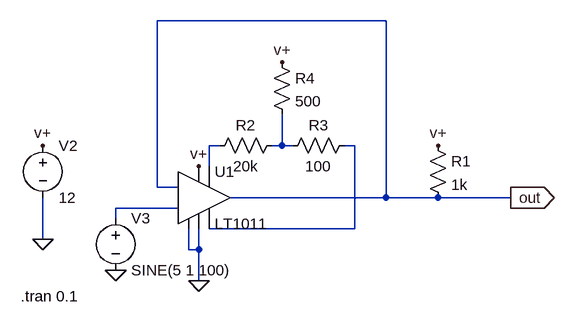
[diagram p0: schematic comparator_with_offset.asc]
comparator_with_offset.asc, the LTspice schematic file:
Version 4
SHEET 1 880 680
WIRE 416 -112 64 -112
WIRE 160 80 144 80
WIRE 256 80 256 32
WIRE 256 80 240 80
WIRE 272 80 256 80
WIRE 368 80 352 80
WIRE 144 112 144 80
WIRE 64 144 64 -112
WIRE 96 144 64 144
WIRE 416 160 416 -112
WIRE 416 160 176 160
WIRE 496 160 416 160
WIRE 608 160 496 160
WIRE 96 176 0 176
WIRE 0 192 0 176
WIRE 368 208 368 80
WIRE 368 208 144 208
WIRE -112 224 -112 160
WIRE 112 240 112 208
WIRE 128 240 128 208
WIRE 128 240 112 240
WIRE 128 288 128 240
FLAG -112 224 0
FLAG -112 80 v+
FLAG 128 112 v+
FLAG 128 288 0
FLAG 0 272 0
FLAG 496 80 v+
FLAG 256 -48 v+
FLAG 608 160 out
IOPIN 608 160 Out
SYMBOL Comparators\\LT1011 128 160 R0
SYMATTR InstName U1
SYMBOL voltage -112 64 R0
WINDOW 123 0 0 Left 0
WINDOW 39 0 0 Left 0
SYMATTR InstName V2
SYMATTR Value 12
SYMBOL voltage 0 176 R0
WINDOW 123 0 0 Left 0
WINDOW 39 0 0 Left 0
SYMATTR InstName V3
SYMATTR Value SINE(5 1 100)
SYMBOL res 480 64 R0
SYMATTR InstName R1
SYMATTR Value 1k
SYMBOL res 256 64 R90
WINDOW 0 0 56 VBottom 2
WINDOW 3 32 56 VTop 2
SYMATTR InstName R2
SYMATTR Value 20k
SYMBOL res 368 64 R90
WINDOW 0 0 56 VBottom 2
WINDOW 3 32 56 VTop 2
SYMATTR InstName R3
SYMATTR Value 100
SYMBOL res 240 -64 R0
SYMATTR InstName R4
SYMATTR Value 500
TEXT -146 312 Left 2 !.tran 0.1

The netlist it stands for:
* comparator_with_offset.asc
XU1 0 N004 out 0 N001 N003 out v+ LT1011
V2 v+ 0 12
V3 N004 0 SINE(5 1 100)
R1 v+ out 1k
R2 N002 N001 20k
R3 N003 N002 100
R4 v+ N002 500
.tran 0.1
.lib LTC1.lib
.backanno
.end